# EasyEDA Pro project 单向户外电源_明月班.epro, board PCB1
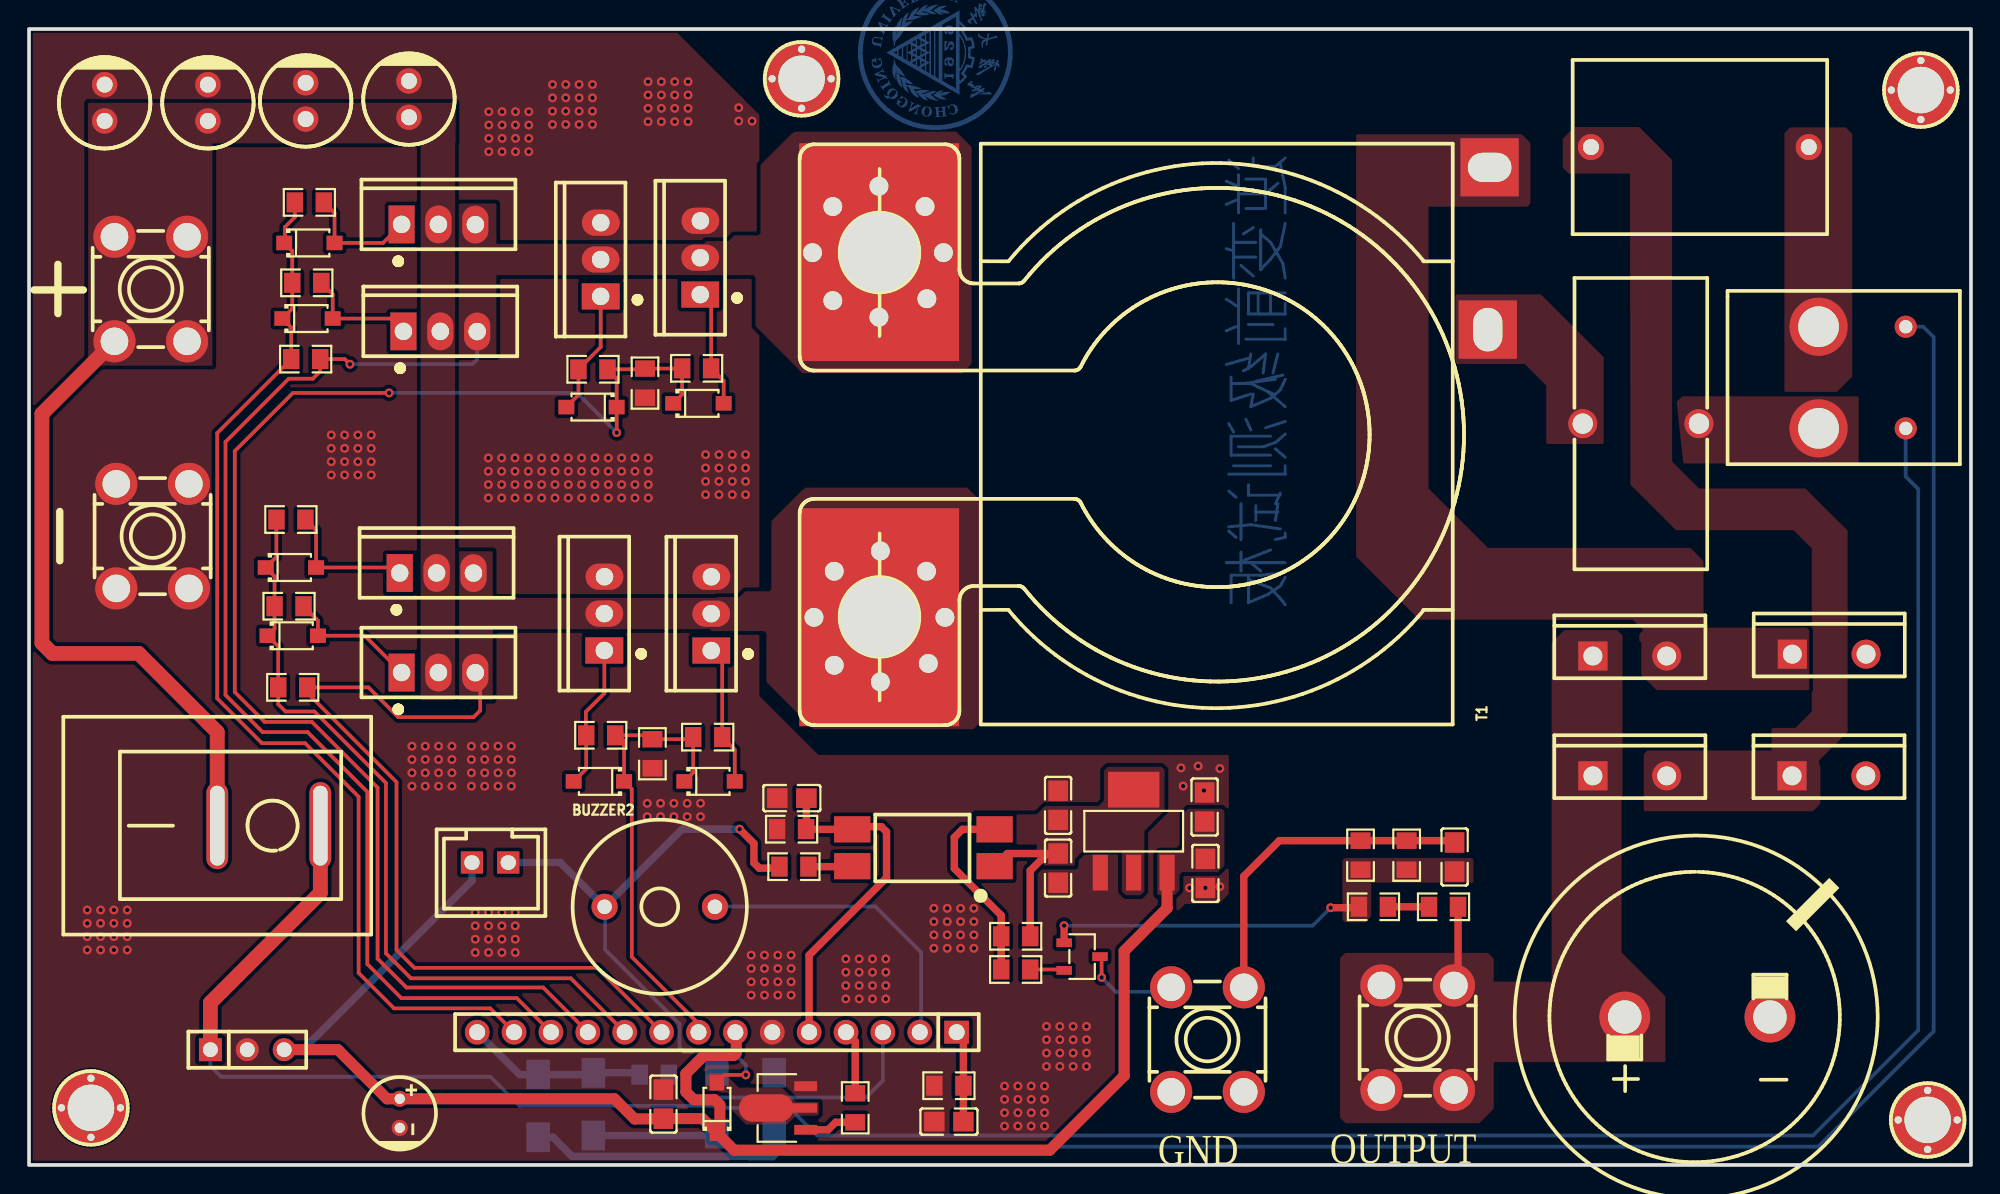
[diagram p14: board, top side]
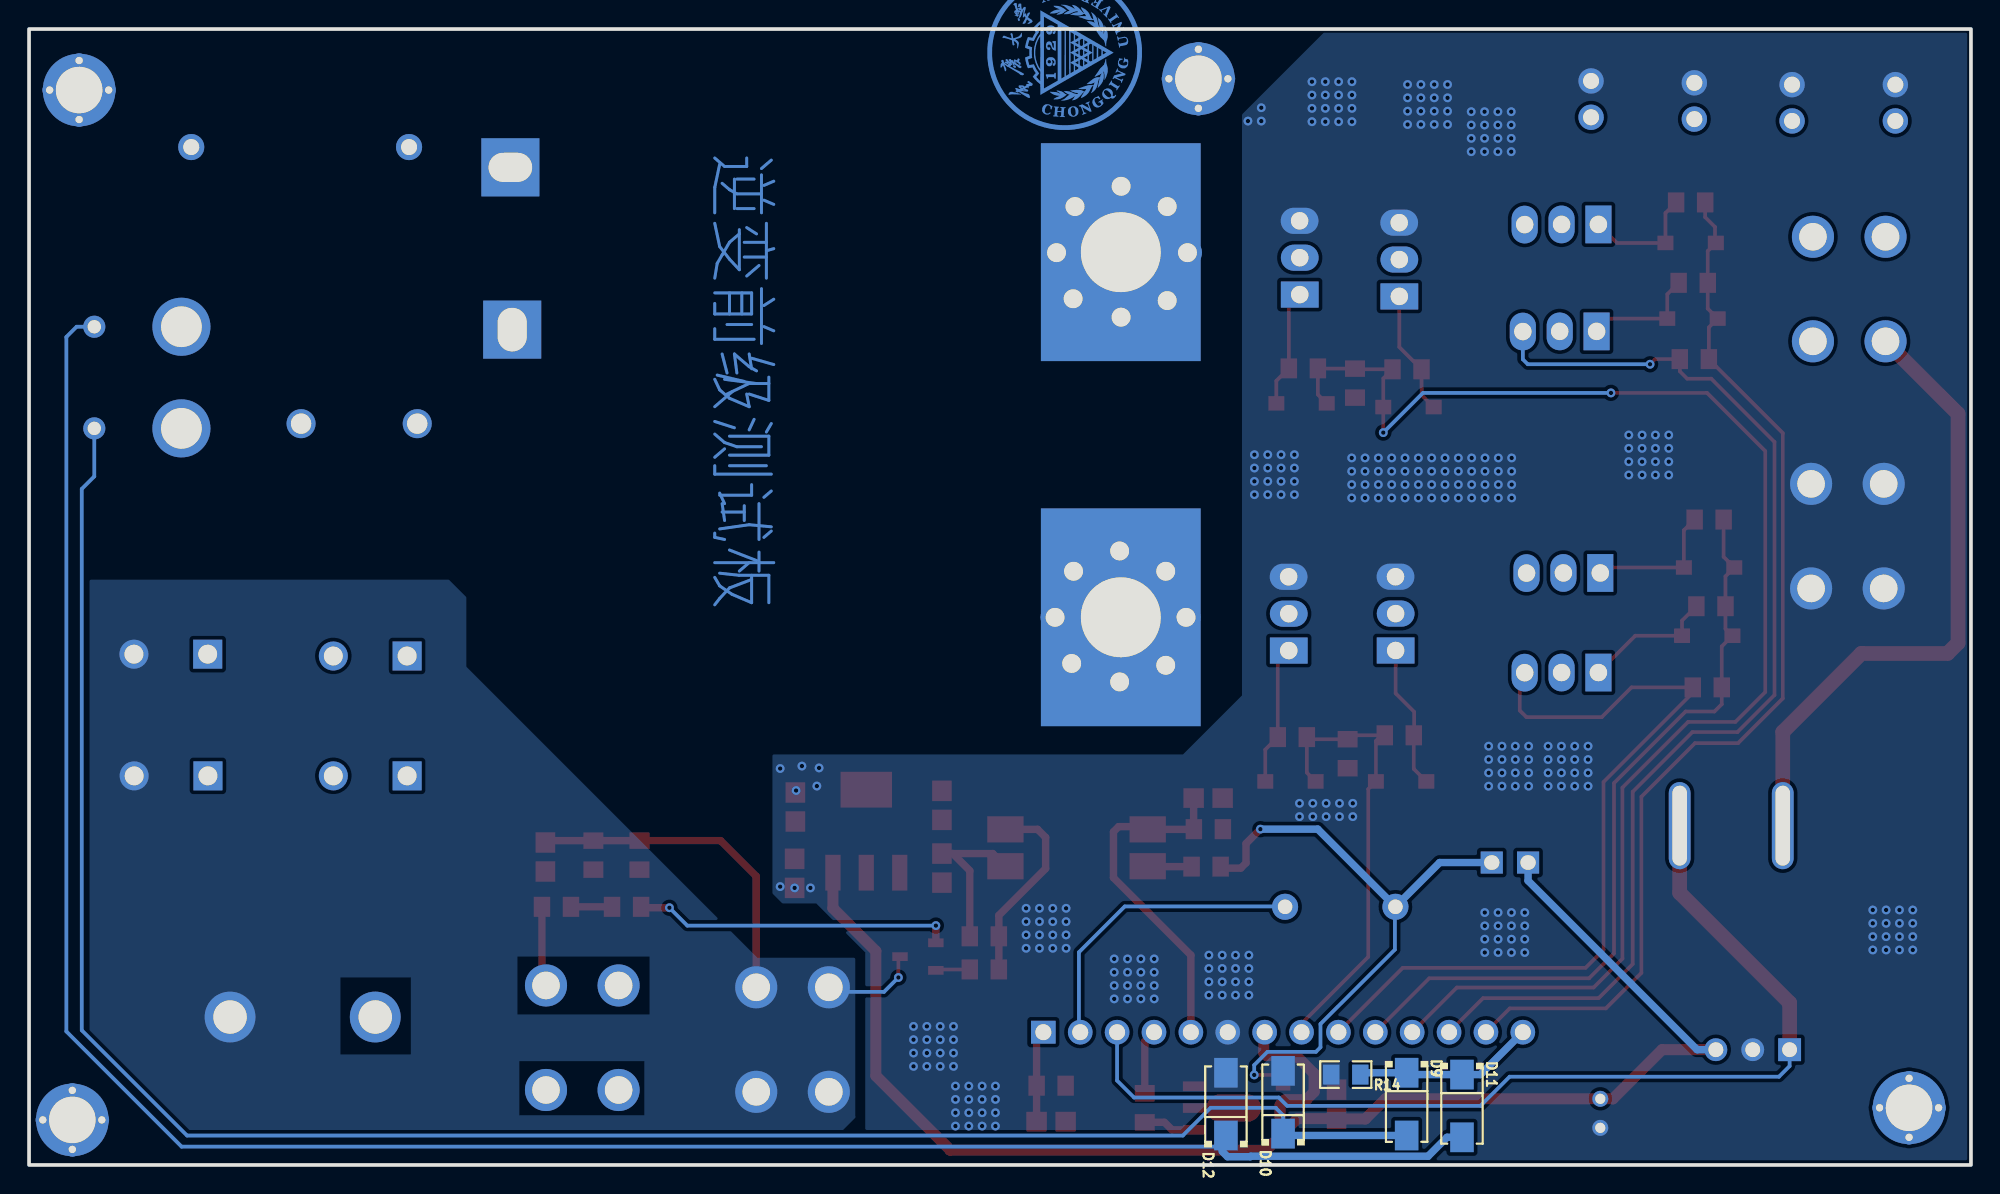
[diagram p15: board, bottom side, seen from below]

Outline 133.73 x 78.23 mm; copper layers: Top Layer, Bottom Layer. Coordinates in mm from the lower left corner of the outline.
Outline path: rectangle 0,78.23 133.73,0
Stack: Top Layer 0.035mm / Dielectric1 1.51mm FR4 er 4.5 / Bottom Layer 0.035mm

## Design rules (mm)
template: 自定义配置
spacing copperThickness1oz (default): track to track 0.102, other pairs 0.152 to 0.3
spacing copperThickness2oz: track to track 0.203, other pairs 0.152 to 0.3
track width copperThickness1oz (default): min 0.127, default 0.254, max 2.54
track width copperThickness2oz: min 0.203, default 0.254, max 2.54
differential pair differentialPair (default): width min 0.127, default 0.254, max 2.54; gap min 0.152, default 0.152
via viaSize (default): diameter min 0.5, default 0.61, max 10; hole min 0.3, default 0.305, max 6.3

## Placement (name value [footprint] x y rotation side)
BUZZER2  2.3kHz  [BUZ-TH_BD12.0-P7.60-D0.6-FD]  43.43 17.78 0 top
C1  22uF  [CAP-TH_BD6.3-P2.50-D0.6-FD-1]  26.16 73.41 90 top
C2  22uF  [CAP-TH_BD6.3-P2.50-D0.6-FD-1]  12.32 73.15 90 top
C3  22uF  [CAP-TH_BD6.3-P2.50-D0.6-FD-1]  19.05 73.28 90 top
C4  22uF  [CAP-TH_BD6.3-P2.50-D0.6-FD-1]  5.21 73.15 90 top
C5  68nF 1kV  [CAP-TH_L17.0-W12.0-P15.00-D0.8]  115.06 70.1 0 top
C6  350uF  [CAP-TH_BD25.0-P10.00-D2.3-FD]  114.89 10.19 0 top
C7  100uF  [CAP-TH_BD5.0-P2.00-D0.5-FD-1]  25.53 3.56 270 top
C8  100nF  [C0805]  43.69 4.19 270 top
C9  100nF  [C0805]  52.53 25.26 0 top
C10  100nF  [C0805]  98.17 21.21 270 top
C11  100nF  [C0805]  63.35 2.99 0 top
C12  100nF  [C0805]  70.87 20.45 90 top
C13  10uF  [C0805]  70.87 24.77 270 top
C14  100nF  [C0805]  81.01 20.08 90 top
C15  10uF  [C0805]  80.96 24.65 270 top
D1  1N4148W  [SOD-123F_L2.7-W1.6-LS3.8-RD]  19.3 63.5 0 top
D2  1N4148W  [SOD-123F_L2.7-W1.6-LS3.8-RD]  19.18 58.29 0 top
D3  1N4148W  [SOD-123F_L2.7-W1.6-LS3.8-RD]  38.73 52.2 180 top
D4  1N4148W  [SOD-123F_L2.7-W1.6-LS3.8-RD]  46.1 52.45 0 top
D5  1N4148W  [SOD-123F_L2.7-W1.6-LS3.8-RD]  18.03 41.15 0 top
D6  1N4148W  [SOD-123F_L2.7-W1.6-LS3.8-RD]  18.16 36.45 0 top
D7  1N4148W  [SOD-123F_L2.7-W1.6-LS3.8-RD]  39.24 26.42 180 top
D8  1N4148W  [SOD-123F_L2.7-W1.6-LS3.8-RD]  46.86 26.42 0 top
D9  FR107  [SMA_L4.2-W2.7-LS5.3-RD]  38.86 4.19 270 bottom
D10  FR107  [SMA_L4.2-W2.7-LS5.3-RD]  47.37 4.32 90 bottom
D11  FR107  [SMA_L4.2-W2.7-LS5.3-RD]  35.05 4.06 270 bottom
D12  FR107  [SMA_L4.2-W2.7-LS5.3-RD]  51.31 4.19 90 bottom
D13  SFF10A06  [ITO-220AC_L10.2-W4.5-P5.10]  110.24 35.05 0 top
D14  SFF10A06  [ITO-220AC_L10.2-W4.5-P5.10]  110.24 26.8 0 top
D15  SFF10A06  [ITO-220AC_L10.2-W4.5-P5.10]  123.97 35.18 0 top
D16  SFF10A06  [ITO-220AC_L10.2-W4.5-P5.10]  123.95 26.8 0 top
D17  1N4148W  [SOD-123F_L2.7-W1.6-LS3.8-RD]  47.37 3.94 90 top
H1  -  [HDR-TH_3P-P2.54-V-F]  15.03 7.94 0 top
H2  -  [HDR-TH_14P-P2.54-V-F-1]  47.37 9.14 180 top
K1  200:1  [FILTER-TH_4P-L12.0-W12.0_FC-CT9825-200T-40A]  126.24 54.23 0 top
P1  XH2.54-2  [CONN-TH_XH2.54-2P]  31.75 20.83 180 top
P8  -  [固定孔]  4.26 3.94 0 top
P9  -  [固定孔]  53.2 74.81 0 top
P10  -  [固定孔]  130.75 3.1 0 top
P11  -  [固定孔]  130.28 74.03 0 top
Q2  IRF3205PBF  [T0-220]  28.19 64.77 0 top
Q3  IRF3205PBF  [T0-220]  28.32 57.4 0 top
Q4  IRF3205PBF  [T0-220]  39.37 62.36 90 top
Q5  IRF3205PBF  [T0-220]  46.23 62.48 90 top
Q6  IRF3205PBF  [T0-220]  28.07 40.77 0 top
Q7  IRF3205PBF  [T0-220]  28.19 33.91 0 top
Q8  IRF3205PBF  [T0-220]  39.62 37.97 90 top
Q9  IRF3205PBF  [T0-220]  46.98 37.97 90 top
Q10  D882  [SOT-89-3_L4.5-W2.5-P1.50-LS4.2-BR]  52.13 3.92 0 top
R1  10R  [R0805]  19.3 66.29 0 top
R2  10K  [R0805]  19.05 55.5 0 top
R3  10R  [R0805]  19.13 60.75 0 top
R5  10R  [R0805]  38.84 54.8 180 top
R6  10K  [R0805]  42.42 53.85 270 top
R7  10R  [R0805]  45.97 54.86 0 top
R8  10R  [R0805]  18.03 44.45 0 top
R9  10K  [R0805]  18.16 32.89 0 top
R10  10R  [R0805]  17.91 38.48 0 top
R11  10R  [R0805]  39.37 29.59 180 top
R12  10K  [R0805]  42.93 28.32 270 top
R13  10R  [R0805]  46.74 29.46 0 top
R14  53R  [R0805]  43.05 6.22 0 bottom
R15  330R  [R0805]  56.9 3.94 90 top
R16  100K  [R0805]  52.67 20.55 0 top
R17  100K  [R0805]  52.51 23.13 0 top
R18  1K  [R0805]  67.94 15.75 0 top
R19  2K  [R0805]  67.94 13.46 180 top
R20  390K  [R0805]  97.41 17.78 0 top
R21  360K  [R0805]  92.58 17.78 0 top
R22  4.7K  [R0805]  91.69 21.34 270 top
R23  100K  [R0805]  94.87 21.34 270 top
R24  10K  [R0805]  63.35 5.46 180 top
T1  -  [EQ4020]  81.79 50.29 90 top
U45  T44001  [CONN-TH_T44001]  8.38 60.32 0 top
U46  T44001  [CONN-TH_T44001]  8.51 43.31 0 top
U47  22uH  [IND-TH_L20.0-W9.0-P8.00-D1.0]  111 51.05 180 top
U48  T44001  [CONN-TH_T44001]  95.63 8.76 0 top
U49  T44001  [CONN-TH_T44001]  81.15 8.64 0 top
U50  PC817CS  [SOP-4_L6.5-W4.6-P2.54-LS10.2-BL]  61.59 21.84 90 top
U52  TL431-0.5%  [SOT-23-3_L2.9-W1.6-P1.90-LS2.8-BR]  72.52 14.35 180 top
U53  KCD1-2P-X  [SW-TH_KCD1-101]  16.51 23.37 0 top
U54  AMS1117-5.0  [SOT-223_L6.5-W3.5-P2.30-LS7.0-BR]  76.07 22.99 270 top

## Footprints (pads in the part's own frame, mm; a bottom-side part is the same pattern mirrored in y, then rotated)
BUZ-TH_BD12.0-P7.60-D0.6-FD
  round 1.8 hole 1: 1(-3.8,0) 2(3.8,0)
C0805
  rect 1.41x1.35 smd: 1(-1,0) 2(1,0)
CAP-TH_BD5.0-P2.00-D0.5-FD-1
  round 1.1 hole 0.7: 1(-1,0) 2(1,0)
CAP-TH_BD6.3-P2.50-D0.6-FD-1
  round 1.75 hole 1.1: 1(-1.25,0) 2(1.25,0)
CAP-TH_BD25.0-P10.00-D2.3-FD
  round 3.5 hole 2.3: 1(-5,0) 2(5,0)
CAP-TH_L17.0-W12.0-P15.00-D0.8
  round 1.8 hole 1.1: 1(-7.5,0) 2(7.5,0)
CONN-TH_T44001
  round 2.9 hole 1.9: 1(-2.5,3.6) 2(-2.5,-3.6) 3(2.5,-3.6) 4(2.5,3.6)
CONN-TH_XH2.54-2P
  rect 1.524x1.524 hole 1.05x1: 1(-1.25,0) 2(1.25,0)
EQ4020
  round 2 hole 1.3: 1(8.095,23.261) 1(9.238,26.436) 1(9.364,19.959) 1(12.54,27.833) 1(12.54,18.816) 1(15.714,26.436) 1(15.714,20.086) 1(17.111,23.261) 2(-17.023,23.16) 2(-15.88,26.335) 2(-15.753,19.858) 2(-12.578,27.733) 2(-12.578,18.715) 2(-9.403,26.335) 2(-9.403,19.985) 2(-8.006,23.16)
  rect 15x11 hole 5.5: 1(12.573,23.241) 2(-12.573,23.241)
  rect 4x4 hole 3x2: 3(7.239,-18.669)
  rect 4x4 hole 2x3: 4(18.415,-18.796)
FILTER-TH_4P-L12.0-W12.0_FC-CT9825-200T-40A
  round 1.524 hole 0.914: 1(3,-3.5) 2(3,3.5)
  round 4 hole 2.8: 3(-3,3.5) 4(-3,-3.5)
HDR-TH_3P-P2.54-V-F
  rect 1.575x1.575 hole 1.02: 1(-2.54,0)
  round 1.575 hole 1.02: 2(0,0) 3(2.54,0)
HDR-TH_14P-P2.54-V-F-1
  rect 1.7x1.575 hole 1.1: 1(-16.51,0)
  round 1.7 hole 1.1: 2(-13.97,0) 3(-11.43,0) 4(-8.89,0) 5(-6.35,0) 6(-3.81,0) 7(-1.27,0) 8(1.27,0) 9(3.81,0) 10(6.35,0) 11(8.89,0) 12(11.43,0) 13(13.97,0) 14(16.51,0)
IND-TH_L20.0-W9.0-P8.00-D1.0
  round 2 hole 1.4: 1(-4,0) 2(4,0)
ITO-220AC_L10.2-W4.5-P5.10
  rect 2x2 hole 1.3: 1(-2.54,0)
  round 2 hole 1.3: 2(2.54,0)
R0805
  rect 1.133x1.377 smd: 1(-1,0) 2(1,0)
SMA_L4.2-W2.7-LS5.3-RD
  rect 2.046x1.62 smd: 1(-2.16,0) 2(2.16,0)
SOD-123F_L2.7-W1.6-LS3.8-RD
  rect 1.1x1 smd: 1(-1.735,0) 2(1.735,0)
SOP-4_L6.5-W4.6-P2.54-LS10.2-BL
  rect 1.8x2.5 smd: 1(-1.27,-4.9) 2(1.27,-4.9) 3(1.27,4.9) 4(-1.27,4.9)
SOT-23-3_L2.9-W1.6-P1.90-LS2.8-BR
  rect 1.07x0.6 smd: 1(1.235,-0.95) 2(1.235,0.95) 3(-1.235,0)
SOT-89-3_L4.5-W2.5-P1.50-LS4.2-BR
  rect 1.575x0.672 smd: 1(1.356,-1.5) 3(1.356,1.5)
  custom 5.377x1.9 smd: 2(-1.356,0)
SOT-223_L6.5-W3.5-P2.30-LS7.0-BR
  rect 2.465x1.05 smd: 1(2.857,-2.3) 2(2.857,0) 3(2.857,2.3)
  rect 2.465x3.54 smd: 4(-2.857,0)
SW-TH_KCD1-101
  oval 1.5x6 hole 1x5.5: 1(3.55,0) 2(-3.55,0)
T0-220
  rect 1.8x2.6 hole 1.2: 1(-2.54,0.005)
  oval 1.8x2.6 hole 1.2: 2(0,0.005) 3(2.54,-0.005)
固定孔
  round 1 hole 0.5x0.505: 1(-2.032,0) 3(2.032,0)
  round 1 hole 0.505x0.5: 2(0,-2.032) 4(0,2.032)
  round 5 hole 3.205x3.2: 5(0,0)

## Nets
As in the schematic.

Pads without a net: P8 1 2 3 4 5; P9 1 2 3 4 5; P10 1 2 3 4 5; P11 1 2 3 4 5

## Via types
v1: diameter 0.61, hole 0.305, Top Layer to Bottom Layer, 305 vias

## Routing (per net, layer and track width the routed paths; a pad name or vN(x,y) marks a point on that pad's centre or on a via; arc(x,y) is an arc through that point)
5V: length 10.9
  Top Layer w0.508: 70.12,21.45 68.94,20.27 R18.2 ; 70.12,21.45 C12.2 ; 70.12,21.45 67.37,21.45 U50.1
12V: length 108.6
  Top Layer w0.762: D17.1 46.38,3.19 C8.2 43.67,3.17 41.7,3.17 40.32,4.56 C7.1 24.65,4.56 21.27,7.94 H1.3 ; D17.1 48.56,1.02 70.29,1.02 75.42,6.14 75.42,14.73 78.37,17.69 78.37,20.13 ; D17.1 47.57,2.41 47.57,4.14 47.21,4.49 45.77,4.49 45.23,5.03 45.23,6.29 46.49,7.54 48.53,7.54 48.7,7.72 48.7,9.21
  Bottom Layer w0.508: P1.2 30.5,19.58 18.86,7.94 H1.3
400V: length 5.5
  Top Layer w0.508: R20.2 98.41,12.64 U48.4
GND-24V:
  vias: v1(4.01,17.56) v1(4.01,16.64) v1(4.01,15.72) v1(4.01,14.81) v1(4.93,17.56) v1(4.93,16.64) v1(4.93,15.72) v1(4.93,14.81) v1(5.84,17.56) v1(5.84,16.64) v1(5.84,15.72) v1(5.84,14.81) v1(6.76,17.56) v1(6.76,16.64) v1(6.76,15.72) v1(6.76,14.81) v1(20.81,50.27) v1(20.81,49.35) v1(20.81,48.44) v1(20.81,47.52) v1(21.73,50.27) v1(21.73,49.35) v1(21.73,48.44) v1(21.73,47.52) v1(22.65,50.27) v1(22.65,49.35) v1(22.65,48.44) v1(22.65,47.52) v1(23.57,50.27) v1(23.57,49.35) v1(23.57,48.44) v1(23.57,47.52) v1(26.37,28.84) v1(26.37,27.92) v1(26.37,27) v1(26.37,26.09) v1(27.29,28.84) v1(27.29,27.92) v1(27.29,27) v1(27.29,26.09) v1(28.2,28.84) v1(28.2,27.92) v1(28.2,27) v1(28.2,26.09) v1(29.12,28.84) v1(29.12,27.92) v1(29.12,27) v1(29.12,26.09) v1(30.46,28.84) v1(30.46,27.92) v1(30.46,27) v1(30.46,26.09) v1(30.73,17.39) v1(30.73,16.47) v1(30.73,15.55) v1(30.73,14.63) v1(31.38,28.84) v1(31.38,27.92) v1(31.38,27) v1(31.38,26.09) v1(31.63,48.69) v1(31.63,47.77) v1(31.63,46.86) v1(31.63,45.94) v1(31.65,17.39) v1(31.65,16.47) v1(31.65,15.55) v1(31.65,14.63) v1(31.66,72.54) v1(31.66,71.62) v1(31.66,70.7) v1(31.66,69.79) v1(32.3,28.84) v1(32.3,27.92) v1(32.3,27) v1(32.3,26.09) v1(32.55,48.69) v1(32.55,47.77) v1(32.55,46.86) v1(32.55,45.94) v1(32.58,72.54) v1(32.58,71.62) v1(32.58,70.7) v1(32.58,69.79) v1(32.56,17.39) v1(32.56,16.47) v1(32.56,15.55) v1(32.56,14.63) v1(33.21,28.84) v1(33.21,27.92) v1(33.21,27) v1(33.21,26.09) v1(33.5,72.54) v1(33.5,71.62) v1(33.5,70.7) v1(33.5,69.79) v1(33.47,48.69) v1(33.47,47.77) v1(33.47,46.86) v1(33.47,45.94) v1(33.48,17.39) v1(33.48,16.47) v1(33.48,15.55) v1(33.48,14.63) v1(34.41,72.54) v1(34.41,71.62) v1(34.41,70.7) v1(34.41,69.79) v1(34.38,48.69) v1(34.38,47.77) v1(34.38,46.86) v1(34.38,45.94) v1(35.3,48.69) v1(35.3,47.77) v1(35.3,46.86) v1(35.3,45.94) v1(36.05,74.41) v1(36.05,73.49) v1(36.05,72.58) v1(36.05,71.66) v1(36.22,48.69) v1(36.22,47.77) v1(36.22,46.86) v1(36.22,45.94) v1(36.96,74.41) v1(36.96,73.49) v1(36.96,72.58) v1(36.96,71.66) v1(37.14,48.69) v1(37.14,47.77) v1(37.14,46.86) v1(37.14,45.94) v1(37.88,74.41) v1(37.88,73.49) v1(37.88,72.58) v1(37.88,71.66) v1(38.06,48.69) v1(38.06,47.77) v1(38.06,46.86) v1(38.06,45.94) v1(38.8,74.41) v1(38.8,73.49) v1(38.8,72.58) v1(38.8,71.66) v1(38.97,48.69) v1(38.97,47.77) v1(38.97,46.86) v1(38.97,45.94) v1(39.89,48.69) v1(39.89,47.77) v1(39.89,46.86) v1(39.89,45.94) v1(40.81,48.69) v1(40.81,47.77) v1(40.81,46.86) v1(40.81,45.94) v1(41.73,48.69) v1(41.73,47.77) v1(41.73,46.86) v1(41.73,45.94) v1(42.63,74.61) v1(42.63,73.69) v1(42.63,72.77) v1(42.63,71.85) v1(42.65,48.69) v1(42.65,47.77) v1(42.65,46.86) v1(42.65,45.94) v1(42.57,24.91) v1(42.57,23.99) v1(43.55,74.61) v1(43.55,73.69) v1(43.55,72.77) v1(43.55,71.85) v1(43.49,24.91) v1(43.49,23.99) v1(44.41,24.91) v1(44.41,23.99) v1(44.46,74.61) v1(44.46,73.69) v1(44.46,72.77) v1(44.46,71.85) v1(45.32,24.91) v1(45.32,23.99) v1(45.38,74.61) v1(45.38,73.69) v1(45.38,72.77) v1(45.38,71.85) v1(46.24,24.91) v1(46.24,23.99) v1(46.59,48.92) v1(46.59,48) v1(46.59,47.08) v1(46.59,46.16) v1(47.51,48.92) v1(47.51,48) v1(47.51,47.08) v1(47.51,46.16) v1(48.43,48.92) v1(48.43,48) v1(48.43,47.08) v1(48.43,46.16) v1(48.87,72.81) v1(48.87,71.89) v1(49.35,48.92) v1(49.35,48) v1(49.35,47.08) v1(49.35,46.16) v1(49.73,14.45) v1(49.73,13.53) v1(49.73,12.61) v1(49.73,11.7) v1(49.79,71.89) v1(50.65,14.45) v1(50.65,13.53) v1(50.65,12.61) v1(50.65,11.7) v1(51.56,14.45) v1(51.56,13.53) v1(51.56,12.61) v1(51.56,11.7) v1(52.48,14.45) v1(52.48,13.53) v1(52.48,12.61) v1(52.48,11.7) v1(56.25,14.19) v1(56.25,13.27) v1(56.25,12.36) v1(56.25,11.44) v1(57.17,14.19) v1(57.17,13.27) v1(57.17,12.36) v1(57.17,11.44) v1(58.08,14.19) v1(58.08,13.27) v1(58.08,12.36) v1(58.08,11.44) v1(59,14.19) v1(59,13.27) v1(59,12.36) v1(59,11.44) v1(62.31,17.68) v1(62.31,16.76) v1(62.31,15.84) v1(62.31,14.92) v1(63.23,17.68) v1(63.23,16.76) v1(63.23,15.84) v1(63.23,14.92) v1(64.15,17.68) v1(64.15,16.76) v1(64.15,15.84) v1(64.15,14.92) v1(65.07,17.68) v1(65.07,16.76) v1(65.07,15.84) v1(65.07,14.92) v1(67.18,5.43) v1(67.18,4.51) v1(67.18,3.6) v1(67.18,2.68) v1(68.1,5.43) v1(68.1,4.51) v1(68.1,3.6) v1(68.1,2.68) v1(69.02,5.43) v1(69.02,4.51) v1(69.02,3.6) v1(69.02,2.68) v1(69.93,5.43) v1(69.93,4.51) v1(69.93,3.6) v1(69.93,2.68) v1(70.07,9.54) v1(70.07,8.63) v1(70.07,7.71) v1(70.07,6.79) v1(70.99,9.54) v1(70.99,8.63) v1(70.99,7.71) v1(70.99,6.79) v1(71.9,9.54) v1(71.9,8.63) v1(71.9,7.71) v1(71.9,6.79) v1(72.82,9.54) v1(72.82,8.63) v1(72.82,7.71) v1(72.82,6.79) v1(79.33,27.34) v1(79.48,26.09) v1(79.92,19.08) v1(80.51,27.47) v1(80.91,25.79) v1(81.01,19.08) v1(82,27.3) v1(82,19.17)
GND-400V: length 30
  Top Layer w0.254: U52.3 73.86,14.24 v1(73.86,12.91)
  Top Layer w0.508: U49.4 83.65,19.88 86.11,22.34 R22.1 R23.1 98.04,22.34 C10.1
  Bottom Layer w0.254: U49.1 78.34,11.92 74.85,11.92 v1(73.86,12.91)
BAT: length 71.2
  Top Layer w1.016: U53.1 20.06,18.74 12.49,11.17 H1.1
  Bottom Layer w0.254: H1.1 12.49,6.81 13.22,6.08 31.77,6.08 33.78,4.07 47.09,4.07 47.66,4.64 57.63,4.64 58.8,5.81 H2.3
BAT+: length 43.9
  Top Layer w1.016: U53.2 12.96,29.82 7.55,35.23 1.61,35.23 0.89,35.95 0.89,51.73 U45.2
BEEP: length 21
  Bottom Layer w0.254: H2.2 61.43,9.23 61.43,14.65 58.28,17.81 47.27,17.81
FAN: length 4.5
  Top Layer w0.508: H2.4 56.9,8.51 R15.2
HO1: length 53.9
  Top Layer w0.254: R8.1 17.03,41.88 D5.1 16.91,40.54 R10.1 16.91,36.93 D6.1 17.16,35.71 R9.1 17.16,31.73 17.66,31.23 19.65,31.23 24.58,26.3 24.58,14.57 26.3,12.86 37.31,12.86 H2.10
HO2: length 74.4
  Top Layer w0.254: R1.1 18.3,65.27 17.62,64.59 17.62,63.55 D1.1 18.13,62.94 R3.1 18.13,58.98 D2.1 18.05,57.68 R2.1 12.96,50.41 12.96,32.13 16.04,29.05 19.01,29.05 22.7,25.36 22.7,13.23 25.14,10.78 31.76,10.78 H2.13
IFB: length 12.5
  Bottom Layer w0.508: R14.1 41.92,6.35 D9.1 38.73,6.22 D11.1 33.78,6.22 H2.14
LO1: length 31.6
  Top Layer w0.254: 40.59,29.59 40.98,29.2 D7.1 41.51,25.89 41.51,14.33 46.1,9.73 H2.8 ; 40.59,29.59 42.66,29.59 R12.1 45.59,29.32 R13.1 45.74,27.02 D8.1 ; 40.59,29.59 R11.1
LO2: length 99.1
  Top Layer w0.254: H2.11 35.41,12.22 25.99,12.22 24,14.21 24,25.99 19.48,30.51 16.22,30.51 14.17,32.57 14.17,49.17 18.17,53.17 v1(24.79,53.17) ; v1(40.47,50.44) D3.1 40.47,54.16 R5.1 42.37,54.8 R6.1 44.96,54.85 R7.1 44.97,53.06 D4.1
  Bottom Layer w0.254: v1(24.79,53.17) 37.74,53.17 v1(40.47,50.44)
TEMP: length 6.4
  Top Layer w0.508: H2.1 64.35,8.68 R24.1 C11.2
VFB: length 23.9
  Top Layer w0.508: H2.5 53.72,14.45 59.05,19.78 59.05,22.94 58.69,23.3 56.88,23.3 U50.3 53.53,23.11 R17.2 53.53,23.14 C9.2
VS1: length 56.9
  Top Layer w0.254: Q7.3 31.07,33.57 31.07,31.3 30.61,30.84 25.43,30.84 23.37,32.89 R9.2 19.16,32.52 25.3,26.37 25.3,14.81 26.54,13.58 39.13,13.58 H2.9
VS2: length 78.8
  Top Layer w0.254: H2.12 33.6,11.49 25.64,11.49 23.3,13.83 23.3,25.7 19.19,29.81 16.08,29.81 13.53,32.36 13.53,49.8 17.88,54.15 19.54,54.15 20.05,54.66 R2.2 21.75,55.5 v1(22.1,55.15)
  Bottom Layer w0.254: Q3.3 30.86,55.49 30.52,55.15 v1(22.1,55.15)
$1N807: length 8.2
  Top Layer w0.254: R1.2 21.04,65.56 D1.2 24.38,63.5 Q2.1
$1N1000: length 8
  Top Layer w0.254: Q3.1 24.9,58.29 D2.2 20.91,59.97 R3.2
$1N1133: length 8.6
  Top Layer w0.254: 39.36,59.82 39.36,56.33 R5.2 37.84,53.03 D3.2
$1N1266: length 8.2
  Top Layer w0.254: Q5.1 46.97,59.19 R7.2 47.84,54 D4.2
$1N1906: length 9.5
  Top Layer w0.254: R8.2 19.77,43.71 D5.2 25.15,41.15 25.53,40.77
$1N1921: length 9.2
  Top Layer w0.254: Q7.1 23.12,36.45 D6.2 19.9,37.49 R10.2
$1N1926: length 9.9
  Top Layer w0.254: Q8.1 39.62,32.48 38.35,31.21 38.35,29.61 R11.2 38.37,27.28 D7.2
$1N1936: length 9.7
  Top Layer w0.254: D8.2 48.6,28.6 R13.2 47.74,34.67 46.98,35.43
$1N4115: length 138.4
  Bottom Layer w0.254: D10.1 47.37,3.43 47.88,3.94 52.36,3.94 54.27,2.03 122.85,2.03 130.1,9.28 130.1,46.56 129.24,47.42 K1.1
  Bottom Layer w0.508: D10.1 47.24,2.03 D9.2
$1N4120: length 151.6
  Bottom Layer w0.254: K1.2 130.45,57.73 131.16,57.02 131.16,9.2 123.22,1.26 52.08,1.26 51.56,1.78
  Bottom Layer w0.508: D11.2 36.08,1.9 37.39,0.6 49.6,0.6 49.63,0.57 51.2,0.57 51.56,0.93 51.56,1.78 D12.1
$1N5553: length 43.9
  Top Layer w0.254: v1(49.36,6.2) 47.9,6.2 D17.2
  Top Layer w0.508: R16.1 51.57,20.44 50.28,20.44 49.92,20.8 49.92,22.14 v1(48.93,23.13)
  Bottom Layer w0.254: v1(49.36,6.2) 49.36,6.88 48.45,7.79 45.11,7.79 44.8,8.1 44.8,9.71 39.67,14.83 39.67,17.81
  Bottom Layer w0.508: v1(48.93,23.13) 44.98,23.13 BUZZER2.1 36.59,20.83 P1.1
$1N5642: length 3.6
  Top Layer w0.508: R15.1 55.54,2.94 55.03,2.42 Q10.1
$1N6418: length 2.4
  Top Layer w0.254: U52.2 71.22,13.46 R19.1
$1N6499: length 2.8
  Top Layer w0.508: R21.2 R20.1
$1N6614: length 22
  Top Layer w0.508: U52.1 v1(71.28,16.48) ; R21.1 91.52,17.72 v1(89.63,17.72)
  Bottom Layer w0.254: v1(89.63,17.72) 88.4,16.48 v1(71.28,16.48)
$1N14100: length 13.4
  Top Layer w0.508: R19.2 R18.1 66.94,17.19 63.72,20.41 63.72,22.56 64.28,23.11 U50.2
$1N14110: length 3
  Top Layer w0.508: U50.4 56.67,20.55 R16.2

## Copper pours and planes (outline as drawn; the poured copper is in the pictures)
5V on Top Layer: 65.18,24.15 69.4,24.15 69.98,24.73 73.66,24.73 74.02,25.09 74.02,27.16 74.29,27.42 77.99,27.42 78.2,27.21 78.2,24.4 76.81,23.01 76.81,18.84 76.54,18.57 75.53,18.57 75.25,18.86 75.25,21.64 72.59,21.64 72.02,21.08 72.02,20.6 69.95,20.6 69.4,21.16 69.4,22.07 65.18,22.07 65.18,22.08
12V on Top Layer: 77.72,18.59 78.9,18.59 79.23,18.93 79.23,19.99 79.41,20.17 81.87,20.17 82.32,20.61 82.32,24.37 82.15,24.54 79.82,24.54 79.49,24.2 79.49,21.92 79.15,21.59 77.86,21.59 77.69,21.41 77.69,18.62
400V on Top Layer: 109.36,36.83 109.73,36.46 109.73,25.45 108.82,24.53 105.34,24.53 104.86,25.02 104.86,35.97 105.72,36.83
400V on Top Layer: 100.47,14.6 100.87,14.2 100.87,3.87 99.87,2.87 90.66,2.87 90.28,3.24 90.28,14.26 90.63,14.6
400V on Top Layer: 104.83,28 109.68,28 109.68,14.63 112.69,11.62 112.69,7.09 98.98,7.09 98.98,12.62 104.86,12.62 104.86,27.97
GND-24V on Top Layer: 0.2,78.39 44.22,78.39 50.29,72.32 50.29,32.31 54.36,28.24 82.63,28.24 82.63,18.67 81.94,17.98 79.61,17.98 76.24,14.61 76.24,1.26 75.27,0.29 0.2,0.29 0.08,0.42 0.08,78.26
GND-24V on Bottom Layer: 0.11,78.42 44.13,78.42 50.2,72.35 50.2,32.33 54.27,28.27 82.54,28.27 82.54,18.7 81.85,18.01 79.52,18.01 76.15,14.64 76.15,1.29 75.18,0.32 0.11,0.32 -0.01,0.45 -0.01,78.29
GND-400V on Bottom Layer: 76.83,14.27 83.57,14.27 103.61,34.31 103.61,39.11 104.82,40.31 129.56,40.31 129.56,7.14 124.76,2.34 77.74,2.34 76.77,3.31 76.83,3.37
(no net) on Top Layer: 47.36,39.06 48.16,38.25 48.16,37.13 47.99,37.13
(no net) on Top Layer: 47.36,39.06 48.16,38.25 48.16,37.13 47.99,37.13 47.76,36.9
BAT+ on Top Layer: 4.07,70.9 12.63,70.9 12.63,55.05 4.07,55.05
BAT+ on Top Layer: 4.06,73.15 29.38,73.15 29.38,70.36 4.06,70.36
BAT+ on Top Layer: 26.97,73.12 29.34,73.12 29.34,32.02 26.97,32.02
VS1 on Top Layer: 30.19,39.06 47.36,39.06 48.16,38.25 48.16,37.13 47.99,37.13 47.76,36.9 30.4,36.9 29.93,37.36 29.93,38.79 30.19,39.04
VS1 on Top Layer: 29.61,42.27 31.94,42.27 31.94,32.03 29.61,32.03
VS1 on Top Layer: 53.48,46.65 64.61,46.65 65.67,45.59 65.67,30.64 65.04,30.01 54.02,30.01 50.78,33.25 50.78,36.61 50.62,36.77 46.94,36.77 46.94,38.65 47.4,39.11 48.92,39.11 49.32,39.51 50.98,39.51 51.12,39.65 51.12,44.36 53.3,46.54 53.36,46.54
VS2 on Top Layer: 52.72,71.17 63.85,71.17 64.91,70.11 64.91,55.16 64.28,54.53 53.26,54.53 50.02,57.77 50.02,61.13 49.87,61.28 46.18,61.28 46.18,63.16 46.64,63.63 48.16,63.63 48.56,64.02 50.22,64.02 50.37,64.17 50.37,68.87 52.55,71.05 52.6,71.05
VS2 on Top Layer: 29.53,66.21 32.19,66.21 32.19,55.7 29.57,55.7 29.57,66.18
VS2 on Top Layer: 29.93,63.44 47.11,63.44 47.91,62.64 47.91,61.51 47.74,61.51 47.51,61.28 30.51,61.28 29.91,61.87 29.91,63.4 29.93,63.42
$1N3910 on Top Layer: 98.26,59.96 104.11,59.96 108.44,55.62 108.44,49.66 104.48,49.66 104.48,53.67 102.99,55.17 98.23,55.17 98.23,59.93
$1N3915 on Top Layer: 113.85,52.94 126,52.94 126,48.31 113.93,48.31 113.46,52.56
$1N3920 on Top Layer: 121.31,71.46 125.1,71.46 125.56,71 125.56,54.3 124.5,53.24 120.88,53.24 120.88,71.06 121.34,71.52 121.34,71.49
$1N4652 on Top Layer: 102.79,70.99 103.39,70.38 103.39,66.21 103.18,66 96.38,66 96.38,46.59 100.47,42.5 114.41,42.5 115.31,41.6 115.31,34.07 114.02,32.78 112.04,32.78 111.18,33.64 111.18,36.82 110.45,37.55 95.73,37.55 91.39,41.9 91.39,70.94 91.43,70.99
$1N4652 on Top Layer: 111.34,37.01 122.41,37.01 122.6,36.82 122.6,32.77 122.53,32.7 112.09,32.7 111.03,33.77 111.03,35.97 110.88,36.12 110.88,36.55
$1N4656 on Top Layer: 120.23,24.4 122.72,24.4 123.27,24.96 123.27,27.86 125.24,29.83 125.24,43.68 122.33,46.59 115.01,46.59 113.15,48.44 113.15,69.21 110.88,71.49 106.42,71.49 105.62,70.68 105.62,68.69 106.04,68.27 110.25,68.27 110.28,46.85 113.42,43.72 121.51,43.72 122.77,42.45 122.77,31.23 121.64,30.1 120,30.1 120,24.63
$1N4656 on Top Layer: 111.46,28.54 122.3,28.54 123.36,27.48 123.36,24.87 122.84,24.36 111.2,24.36 111.2,28.29
$1N5553 on Top Layer: 46.86,6.34 47.94,6.34 48.17,6.11 48.17,6.03 48.87,5.33 51.85,5.33 52.84,4.34 54.35,4.34 54.39,4.3 54.39,3.51 54.28,3.4 52.82,3.4 52.21,2.78 49.38,2.78 48.43,3.74 48.43,4.63 48.08,4.98 46.78,4.98 46.6,5.16 46.6,6.19 46.72,6.19
$1N6614 on Top Layer: 90.61,16.72 92.02,16.72 92.42,17.12 92.42,19.44 99.47,19.44 99.47,21.02 99.34,21.14 90.62,21.14 90.45,20.97 90.45,16.88

Small or netless copper shapes (teardrops, artwork), in the pictures only: 43 on Bottom Layer

## Text on the board
Bottom Layer: 逆变前级测试板
Bottom Solder Mask Layer: 逆变前级测试板
Top Silkscreen Layer: GND | OUTPUT
